# Altium schematic sheet Lab2_Scheme.SchDoc: Название платы
size 420 x 297 mm; ApprovedBy: Рогов; CheckedBy: Фамилия проверяющего; DrawnBy: Фамилия разработчика; DocumentNumber: Введите номер платы + Э3; SheetNumber: пусто если лист 1, иначе 1; SheetTotal: количество листов; Title1str: (при необходимости вторая строка); DocumentType: тип схемы; Format: A3; ImagePath: Введите номер платы
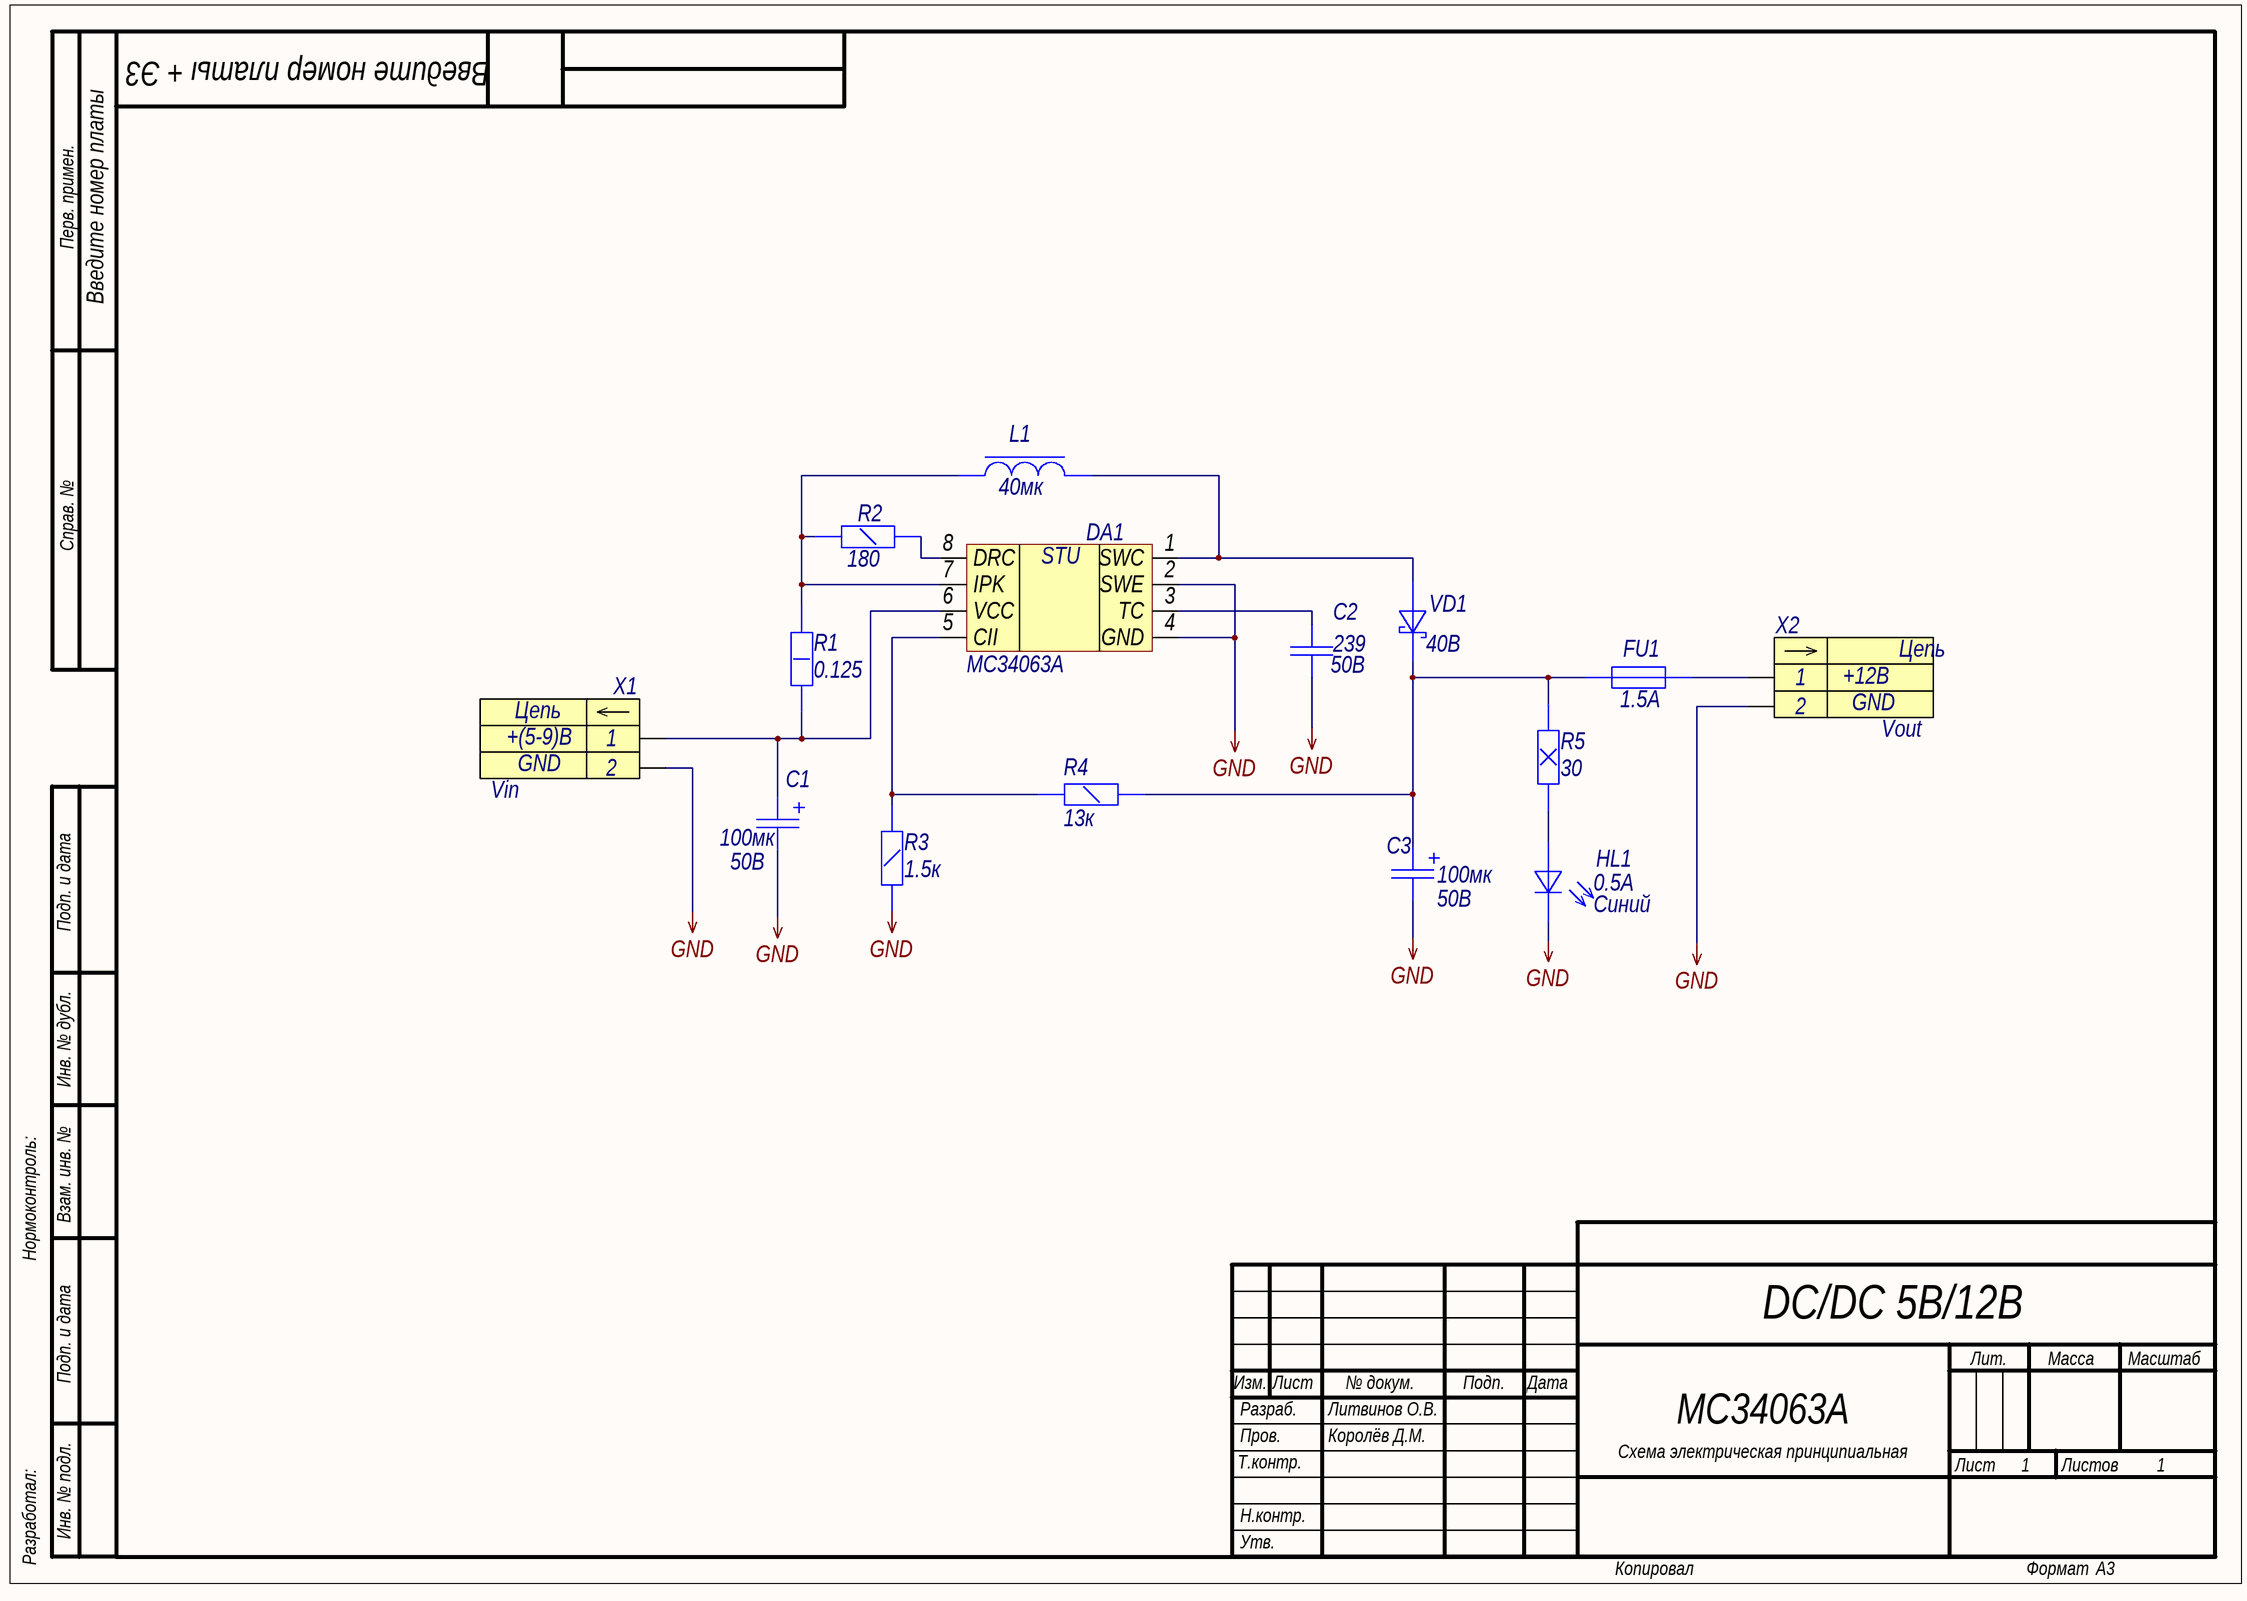
[diagram p0: Lab2_Scheme.SchDoc]

## Parts
C1  Ёмкость: 100мк  Напряжение: 50В  [C1206]  (hidden comment: Capacitor-E)
C2  Ёмкость: 239  Напряжение: 50В  [R0805]  (hidden comment: Capacitor)
C3  Ёмкость: 100мк  Напряжение: 50В  [C1206]  (hidden comment: Capacitor-E)
DA1  MC34063A  [PCBComponent_1]
FU1  value 1.5A  [F1812]  (hidden comment: Fuse)
HL1  Прямой ток: 0.5А  Цвет: Синий  [LD0805]  (hidden comment: LED_3V)
L1  value 40мк  [МДГ-2]  (hidden comment: Coil)
R1  value 0.125  [R0805]  (hidden comment: Resistor_1,0W)
R2  Сопротивление: 180  [R0805]  (hidden comment: Resistor_0,25W)
R3  value 1.5к  [R0805]  (hidden comment: Resistor_0,25W)
R4  value 13к  (hidden comment: Resistor_0,25W)
R5  Сопротивление: 30  [R0805]  (hidden comment: Resistor_10,0W)
VD1  Максимальное обратное напряжение: 40В  [DO-214AC]  (hidden comment: Schottky)
X1  Vin  U: +(5-9)В  [WF-2]
X2  Vout  U: +12В  [CWF-2]

## Nets
GND: C1.2 C2.1 C3.2 DA1.2(SWE) DA1.4(GND) HL1.2(К) R3.1 X1.2 X2.2
NetC1_1: C1.1 DA1.6(VCC) R1.1 X1.1
NetC2_2: C2.2 DA1.3(TC)
NetC3_1: C3.1 FU1.2 R4.2 R5.2 VD1.2(К)
NetDA1_1: DA1.1(SWC) L1.2 VD1.1(А)
NetDA1_5: DA1.5(CII) R3.2 R4.1
NetDA1_7: DA1.7(IPK) L1.1 R1.2 R2.1
NetDA1_8: DA1.8(DRC) R2.2
NetFU1_1: FU1.1 X2.1
NetHL1_1: HL1.1(А) R5.1

## Notes on the sheet
- Перв. примен.
- Справ. №
- Подп. и дата
- Инв. № дубл.
- Нормоконтроль:
- Взам. инв. №
- DC/DС 5В/12В
- Изм.
- Лист
- № докум.
- Подп.
- Дата
- Лит.
- Масса
- Масштаб
- Т.контр.
- Пров.
- Разраб.
- Королёв Д.М.
- Литвинов О.В.
- MC34063A
- Схема электрическая принципиальная
- 1
- Листов
- Разработал:
- Инв. № подл.
- Н.контр.
- Утв.
- Копировал
- Формат
- (in symbol MC34063A) STU
- (in symbol Vin) Цепь
- (in symbol Vout) Цепь

## Library data of the parts
C1 C3 = Capacitor-E: Type: Конденсатор; Published: 20.08.2010; Publisher: Олег Литвинов
C2 = Capacitor: Type: Конденсатор; Published: 18.05.2010; Publisher: Andrew Danich
HL1 = Led-1: Type: Индикатор единичный; Прямое напряжение: 3.3В; Произв. номер: SMLE13EC8TT86; Published: 03.12.2013; Publisher: Andrew Danich
L1 = КИВ18-100: Manufacturer: ОАО "МСТАТОР"; Type: Дроссель; ID: 1; Rated Current: 185mA; Tolerance: ±10%; Q: 20; DC Resistance: 1.2ohm; Specification: КВШУ.670114.001 ТУ; Application Category: 5; Working Temperature Min: -60°С; Working Temperature Max: +85°С; Published: 20.05.2010; Publisher: Andrew Danich; Part Number: КИВ18-100; Footprint: 0603
VD1 = Schottky: BYV10-40; Type: Диод; Прямой ток: 1 А
X1 = Vin: Create: DeathSpeaker; Out: D-; In: D+; GND: GND
X2 = Vout: Create: DeathSpeaker; GND: GND
FU1 = Fuse: Type: Вставка плавкая
R1 = Resistor_1,0W: Type: Резистор
R2-R4 = Resistor_0,25W: Type: Резистор
R5 = Resistor_10,0W: Type: Резистор